# Altium schematic sheet GENERAL-IO.SchDoc
size A3
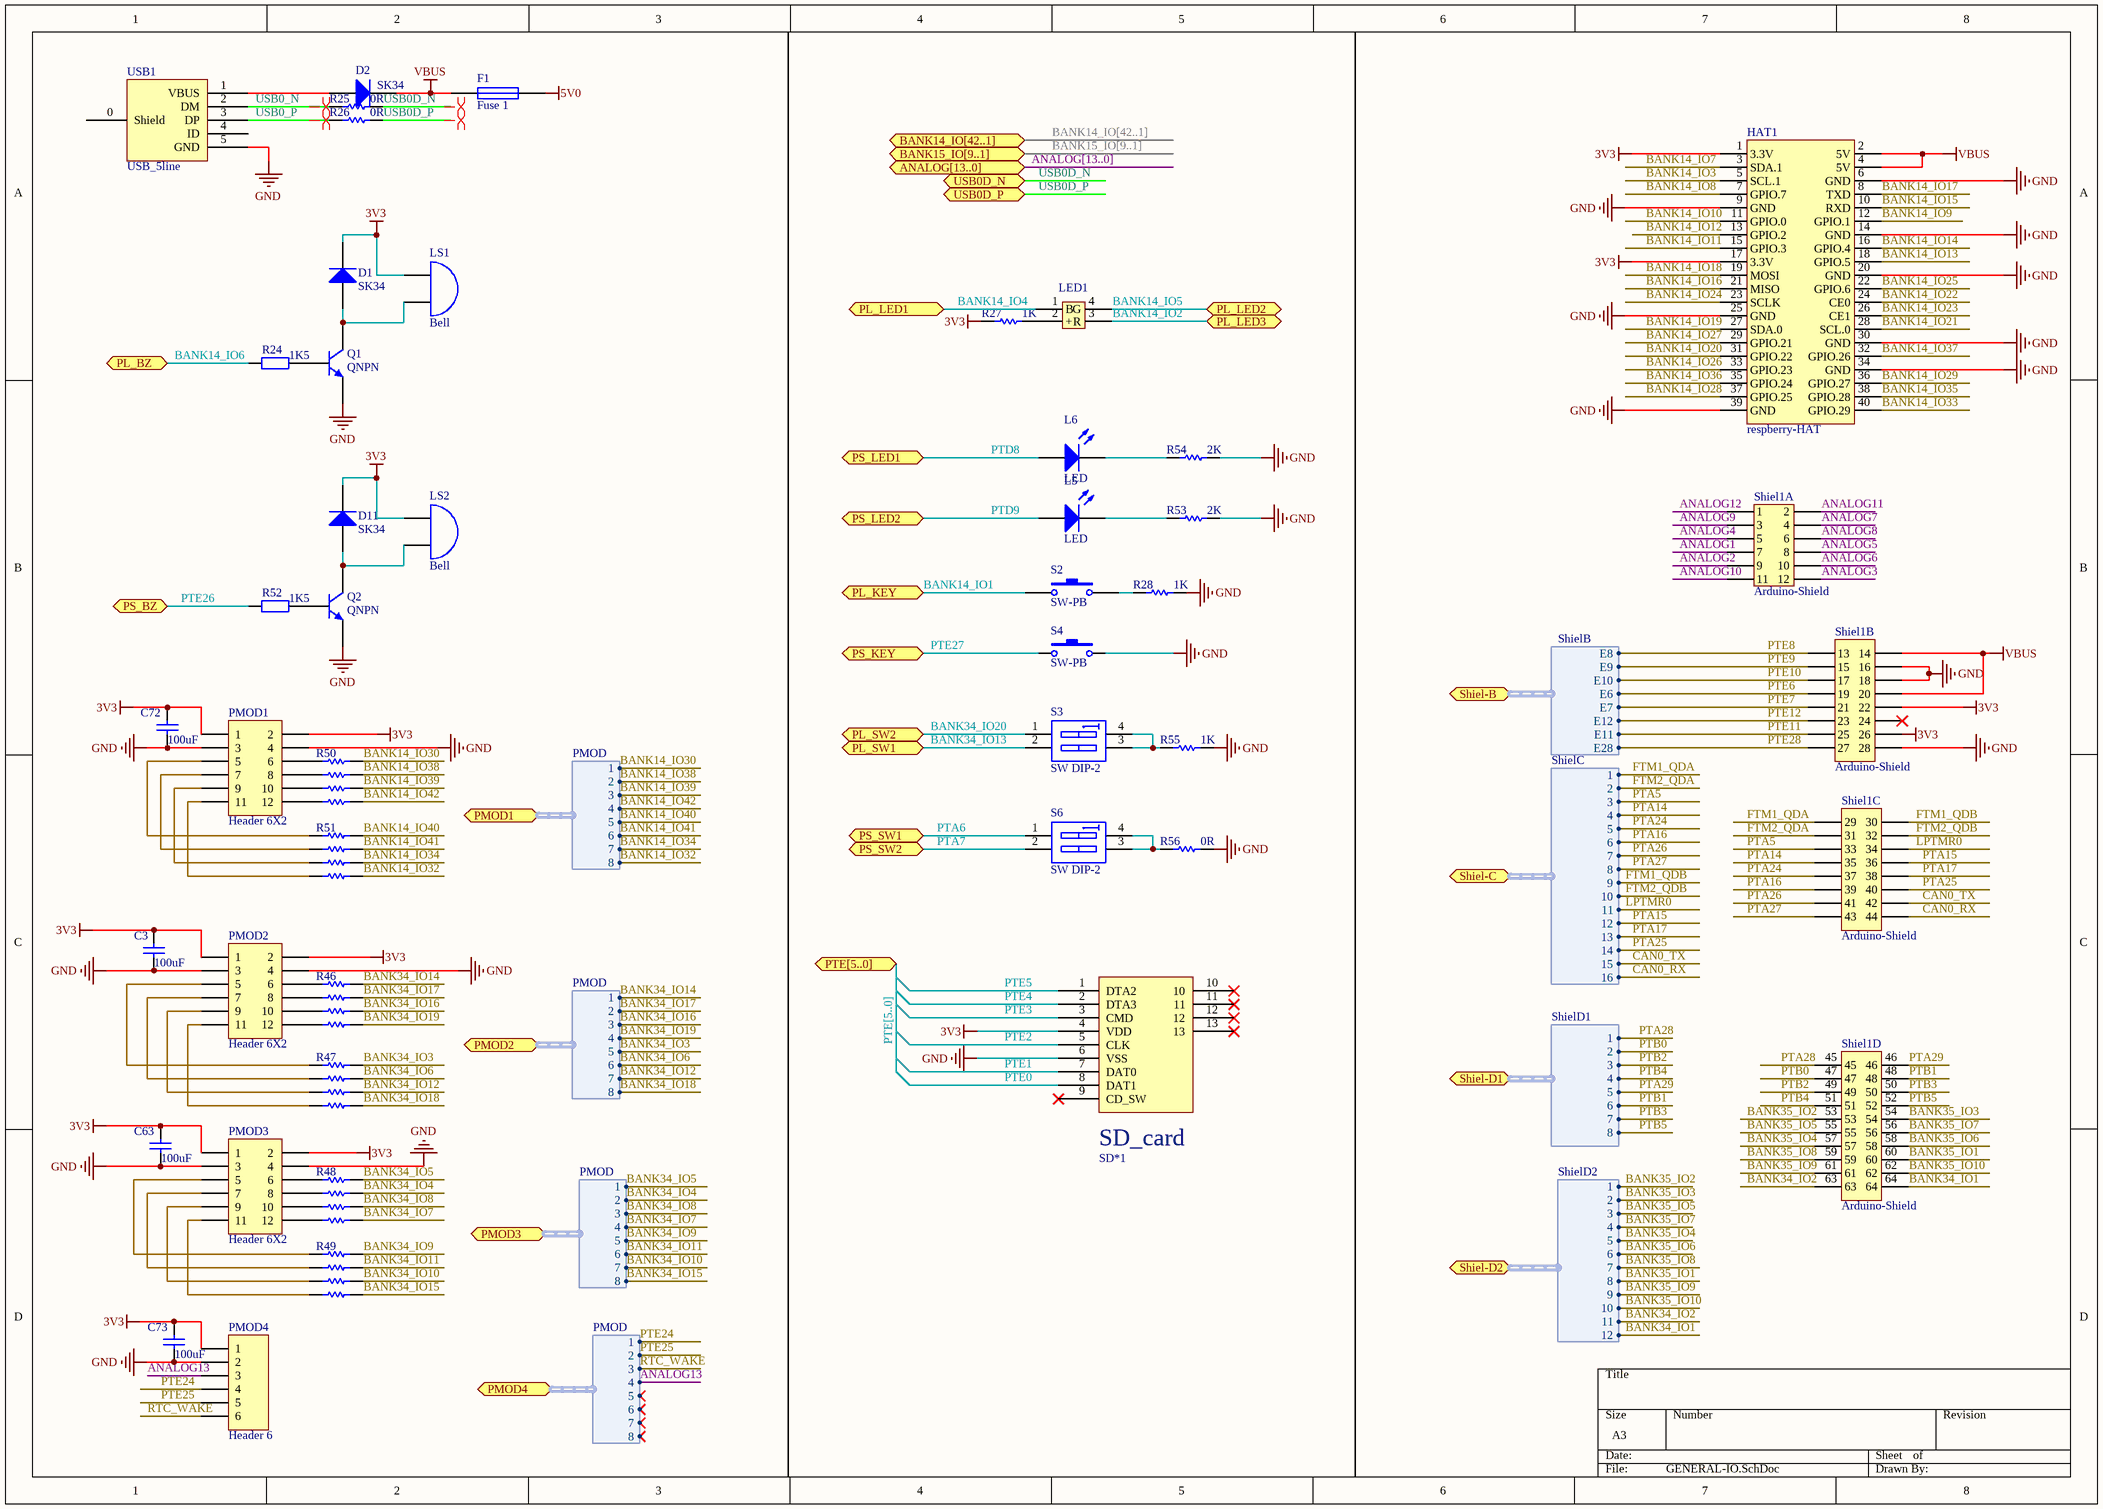
[diagram p0: GENERAL-IO.SchDoc]

## Parts
C3  value 100uF  [1206]  (hidden comment: Cap)
C63  value 100uF  [1206]  (hidden comment: Cap)
C72  value 100uF  [1206]  (hidden comment: Cap)
C73  value 100uF  [1206]  (hidden comment: Cap)
D1  SK34  [1206]
D2  SK34  [1206]
D11  SK34  [1206]
F1  Fuse 1  [1206]
HAT1  respberry-HAT  [SMT-HAT]
L5  LED  [1608[0603]]
L6  LED  [1608[0603]]
LED1  RGB_LED1206  [RGB]  (value not drawn)
LS1  Bell  [MLT-5020 BZ]
LS2  Bell  [BZ]
PMOD1  Header 6X2  [HDR2X6]
PMOD2  Header 6X2  [HDR2X6]
PMOD3  Header 6X2  [HDR2X6]
PMOD4  Header 6  [HDR1X6]
Q1  QNPN  [SOT23_N]
Q2  QNPN  [SOT23_N]
R24  value 1K5  [1608[0603]]  (hidden comment: Res2)
R25  value 0R  [1608[0603]]  (hidden comment: Res)
R26  value 0R  [1608[0603]]  (hidden comment: Res)
R27  value 1K  [1608[0603]]  (hidden comment: Res)
R28  value 1K  [1608[0603]]  (hidden comment: Res)
R46  res*4  [0603*4]  (value not drawn)
R47  res*4  [0603*4]  (value not drawn)
R48  res*4  [0603*4]  (value not drawn)
R49  res*4  [0603*4]  (value not drawn)
R50  res*4  [0603*4]  (value not drawn)
R51  res*4  [0603*4]  (value not drawn)
R52  value 1K5  [1608[0603]]  (hidden comment: Res2)
R53  value 2K  [1608[0603]]  (hidden comment: Res)
R54  value 2K  [1608[0603]]  (hidden comment: Res)
R55  value 1K  [1608[0603]]  (hidden comment: Res)
R56  value 0R  [1608[0603]]  (hidden comment: Res)
S2  SW-PB  [key 3*4*2]
S3  SW DIP-2  [sw*2]
S4  SW-PB  [key 3*4*2]
S6  SW DIP-2  [sw*2]
SD*1  TF_card  [TF卡座(短体)]  (value not drawn)
Shiel1  Arduino-Shield  [SMT-B-Shield]  (parts A,B,C,D of 4)
USB1  USB_5line  [USB-MICRO-5P-2F]

## Ports
ANALOG[13..0] (harness Flexbus), BANK14_IO[42..1], BANK15_IO[9..1], PL_BZ, PL_KEY, PL_LED1, PL_LED2, PL_LED3, PL_SW1, PL_SW2, PMOD1 (harness PMOD), PMOD2 (harness PMOD), PMOD3 (harness PMOD), PMOD4 (harness PMOD), PS_BZ, PS_KEY, PS_LED1, PS_LED2, PS_SW1, PS_SW2, PTE[5..0], Shiel-B (harness ShielB), Shiel-C (harness ShielC), Shiel-D1 (harness ShielD1), Shiel-D2 (harness ShielD2), USB0D_N, USB0D_P

## Harnesses
ShielB: E8, E9, E10, E6, E7, E12, E11, E28
PMOD: 1, 2, 3, 4, 5, 6, 7, 8
ShielC: 1, 2, 3, 4, 5, 6, 7, 8, 9, 10, 11, 12, 13, 14, 15, 16
ShielD1: 1, 2, 3, 4, 5, 6, 7, 8
ShielD2: 1, 2, 3, 4, 5, 6, 7, 8, 9, 10, 11, 12

## Nets
3V3: C3.1 C63.1 C72.1 C73.1 D1.2(K) D11.2(K) HAT1.1(3.3V) HAT1.17(3.3V) LS1.1(A) LS2.1(A) PMOD1.1 PMOD1.2 PMOD2.1 PMOD2.2 PMOD3.1 PMOD3.2 PMOD4.1 R27.2 SD*1.4(VDD) Shiel1.22 Shiel1.26
5V0: F1.1
GND: C3.2 C63.2 C72.2 C73.2 HAT1.6(GND) HAT1.9(GND) HAT1.14(GND) HAT1.20(GND) HAT1.25(GND) HAT1.30(GND) HAT1.34(GND) HAT1.39(GND) PMOD1.3 PMOD1.4 PMOD2.3 PMOD2.4 PMOD3.3 PMOD3.4 PMOD4.2 Q1.3(E) Q2.3(E) R28.1 R53.1 R54.1 R55.1 R56.1 S4.2 SD*1.6(VSS) Shiel1.16 Shiel1.18 Shiel1.28 USB1.5(GND)
VBUS: D2.2(K) F1.2 HAT1.2(5V) HAT1.4(5V) Shiel1.14 Shiel1.20
ANALOG1: Shiel1.7
ANALOG2: Shiel1.9
ANALOG3: Shiel1.12
ANALOG4: Shiel1.5
ANALOG5: Shiel1.8
ANALOG6: Shiel1.10
ANALOG7: Shiel1.4
ANALOG8: Shiel1.6
ANALOG9: Shiel1.3
ANALOG10: Shiel1.11
ANALOG11: Shiel1.2
ANALOG12: Shiel1.1
ANALOG13: PMOD4.3 ; port PMOD4.4
BANK14_IO1: S2.1 ; port PL_KEY
BANK14_IO2: LED1.3(R) ; port PL_LED3
BANK14_IO3: HAT1.5(SCL.1)
BANK14_IO4: LED1.1(B) ; port PL_LED1
BANK14_IO5: LED1.4(G) ; port PL_LED2
BANK14_IO6: R24.2 ; port PL_BZ
BANK14_IO7: HAT1.3(SDA.1)
BANK14_IO8: HAT1.7(GPIO.7)
BANK14_IO9: HAT1.12(GPIO.1)
BANK14_IO10: HAT1.11(GPIO.0)
BANK14_IO11: HAT1.15(GPIO.3)
BANK14_IO12: HAT1.13(GPIO.2)
BANK14_IO13: HAT1.18(GPIO.5)
BANK14_IO14: HAT1.16(GPIO.4)
BANK14_IO15: HAT1.10(RXD)
BANK14_IO16: HAT1.21(MISO)
BANK14_IO17: HAT1.8(TXD)
BANK14_IO18: HAT1.19(MOSI)
BANK14_IO19: HAT1.27(SDA.0)
BANK14_IO20: HAT1.31(GPIO.22)
BANK14_IO21: HAT1.28(SCL.0)
BANK14_IO22: HAT1.24(CE0)
BANK14_IO23: HAT1.26(CE1)
BANK14_IO24: HAT1.23(SCLK)
BANK14_IO25: HAT1.22(GPIO.6)
BANK14_IO26: HAT1.33(GPIO.23)
BANK14_IO27: HAT1.29(GPIO.21)
BANK14_IO28: HAT1.37(GPIO.25)
BANK14_IO29: HAT1.36(GPIO.27)
BANK14_IO30: R50.2 ; port PMOD1.1
BANK14_IO32: R51.8 ; port PMOD1.8
BANK14_IO33: HAT1.40(GPIO.29)
BANK14_IO34: R51.6 ; port PMOD1.7
BANK14_IO35: HAT1.38(GPIO.28)
BANK14_IO36: HAT1.35(GPIO.24)
BANK14_IO37: HAT1.32(GPIO.26)
BANK14_IO38: R50.4 ; port PMOD1.2
BANK14_IO39: R50.6 ; port PMOD1.3
BANK14_IO40: R51.2 ; port PMOD1.5
BANK14_IO41: R51.4 ; port PMOD1.6
BANK14_IO42: R50.8 ; port PMOD1.4
BANK34_IO1: Shiel1.64 ; port Shiel-D2.12
BANK34_IO2: Shiel1.63 ; port Shiel-D2.11
BANK34_IO3: R47.2 ; port PMOD2.5
BANK34_IO4: R48.4 ; port PMOD3.2
BANK34_IO5: R48.2 ; port PMOD3.1
BANK34_IO6: R47.4 ; port PMOD2.6
BANK34_IO7: R48.8 ; port PMOD3.4
BANK34_IO8: R48.6 ; port PMOD3.3
BANK34_IO9: R49.2 ; port PMOD3.5
BANK34_IO10: R49.6 ; port PMOD3.7
BANK34_IO11: R49.4 ; port PMOD3.6
BANK34_IO12: R47.6 ; port PMOD2.7
BANK34_IO13: S3.2(A2) ; port PL_SW1
BANK34_IO14: R46.2 ; port PMOD2.1
BANK34_IO15: R49.8 ; port PMOD3.8
BANK34_IO16: R46.6 ; port PMOD2.3
BANK34_IO17: R46.4 ; port PMOD2.2
BANK34_IO18: R47.8 ; port PMOD2.8
BANK34_IO19: R46.8 ; port PMOD2.4
BANK34_IO20: S3.1(A1) ; port PL_SW2
BANK35_IO1: Shiel1.60 ; port Shiel-D2.8
BANK35_IO2: Shiel1.53 ; port Shiel-D2.1
BANK35_IO3: Shiel1.54 ; port Shiel-D2.2
BANK35_IO4: Shiel1.57 ; port Shiel-D2.5
BANK35_IO5: Shiel1.55 ; port Shiel-D2.3
BANK35_IO6: Shiel1.58 ; port Shiel-D2.6
BANK35_IO7: Shiel1.56 ; port Shiel-D2.4
BANK35_IO8: Shiel1.59 ; port Shiel-D2.7
BANK35_IO9: Shiel1.61 ; port Shiel-D2.9
BANK35_IO10: Shiel1.62 ; port Shiel-D2.10
CAN0_RX: Shiel1.44 ; port Shiel-C.16
CAN0_TX: Shiel1.42 ; port Shiel-C.15
FTM1_QDA: Shiel1.29 ; port Shiel-C.1
FTM1_QDB: Shiel1.30 ; port Shiel-C.9
FTM2_QDA: Shiel1.31 ; port Shiel-C.2
FTM2_QDB: Shiel1.32 ; port Shiel-C.10
LPTMR0: Shiel1.34 ; port Shiel-C.11
PTA5: Shiel1.33 ; port Shiel-C.3
PTA6: S6.1(A1) ; port PS_SW1
PTA7: S6.2(A2) ; port PS_SW2
PTA14: Shiel1.35 ; port Shiel-C.4
PTA15: Shiel1.36 ; port Shiel-C.12
PTA16: Shiel1.39 ; port Shiel-C.6
PTA17: Shiel1.38 ; port Shiel-C.13
PTA24: Shiel1.37 ; port Shiel-C.5
PTA25: Shiel1.40 ; port Shiel-C.14
PTA26: Shiel1.41 ; port Shiel-C.7
PTA27: Shiel1.43 ; port Shiel-C.8
PTA28: Shiel1.45 ; port Shiel-D1.1
PTA29: Shiel1.46 ; port Shiel-D1.5
PTB0: Shiel1.47 ; port Shiel-D1.2
PTB1: Shiel1.48 ; port Shiel-D1.6
PTB2: Shiel1.49 ; port Shiel-D1.3
PTB3: Shiel1.50 ; port Shiel-D1.7
PTB4: Shiel1.51 ; port Shiel-D1.4
PTB5: Shiel1.52 ; port Shiel-D1.8
PTD8: L6.1(A) ; port PS_LED1
PTD9: L5.1(A) ; port PS_LED2
PTE0: SD*1.8(DAT1)
PTE1: SD*1.7(DAT0)
PTE2: SD*1.5(CLK)
PTE3: SD*1.3(CMD)
PTE4: SD*1.2(DTA3)
PTE5: SD*1.1(DTA2)
PTE6: Shiel1.19 ; port Shiel-B.E6
PTE7: Shiel1.21 ; port Shiel-B.E7
PTE8: Shiel1.13 ; port Shiel-B.E8
PTE9: Shiel1.15 ; port Shiel-B.E9
PTE10: Shiel1.17 ; port Shiel-B.E10
PTE11: Shiel1.25 ; port Shiel-B.E11
PTE12: Shiel1.23 ; port Shiel-B.E12
PTE24: PMOD4.4 ; port PMOD4.1
PTE25: PMOD4.5 ; port PMOD4.2
PTE26: R52.2 ; port PS_BZ
PTE27: S4.1 ; port PS_KEY
PTE28: Shiel1.27 ; port Shiel-B.E28
RTC_WAKE: PMOD4.6 ; port PMOD4.3
USB0_N: R25.1 USB1.2(DM)
USB0_P: R26.1 USB1.3(DP)
USB0D_N: R25.2 ; port USB0D_N
USB0D_P: R26.2 ; port USB0D_P
NetD1_1: D1.1(A) LS1.2(B) Q1.1(C)
NetD2_1: D2.1(A) USB1.1(VBUS)
NetD11_1: D11.1(A) LS2.2(B) Q2.1(C)
NetL5_2: L5.2(K) R53.2
NetL6_2: L6.2(K) R54.2
NetLED1_2: LED1.2(+) R27.1
NetPMOD1_5: PMOD1.5 R51.1
NetPMOD1_6: PMOD1.6 R50.1
NetPMOD1_7: PMOD1.7 R51.3
NetPMOD1_8: PMOD1.8 R50.3
NetPMOD1_9: PMOD1.9 R51.5
NetPMOD1_10: PMOD1.10 R50.5
NetPMOD1_11: PMOD1.11 R51.7
NetPMOD1_12: PMOD1.12 R50.7
NetPMOD2_5: PMOD2.5 R47.1
NetPMOD2_6: PMOD2.6 R46.1
NetPMOD2_7: PMOD2.7 R47.3
NetPMOD2_8: PMOD2.8 R46.3
NetPMOD2_9: PMOD2.9 R47.5
NetPMOD2_10: PMOD2.10 R46.5
NetPMOD2_11: PMOD2.11 R47.7
NetPMOD2_12: PMOD2.12 R46.7
NetPMOD3_5: PMOD3.5 R49.1
NetPMOD3_6: PMOD3.6 R48.1
NetPMOD3_7: PMOD3.7 R49.3
NetPMOD3_8: PMOD3.8 R48.3
NetPMOD3_9: PMOD3.9 R49.5
NetPMOD3_10: PMOD3.10 R48.5
NetPMOD3_11: PMOD3.11 R49.7
NetPMOD3_12: PMOD3.12 R48.7
NetQ1_2: Q1.2(B) R24.1
NetQ2_2: Q2.2(B) R52.1
NetR28_2: R28.2 S2.2
NetR55_2: R55.2 S3.3(B2) S3.4(B1)
NetR56_2: R56.2 S6.3(B2) S6.4(B1)

Not connected (* = marked no-connect by the designer): SD*1 9(CD_SW)* 10* 11* 12* 13*; Shiel1 24*; USB1 0(Shield) 4(ID)

## Buses and harness runs
bus ANALOG[13..0]
bus BANK14_IO[42..1] = port BANK14_IO[42..1]
bus BANK15_IO[9..1] = port BANK15_IO[9..1]
bus PTE[5..0] = port PTE[5..0]

## Layout directives
differential pair: USB0_N, USB0_P, USB0D_N, USB0D_P

## Notes on the sheet
- (in symbol TF_card) SD_card

## Library data of the parts
C3 C63 C72 C73 = Cap: 贴片电容; Published: 8-Jun-2000; LatestRevisionDate: 17-Jul-2002; LatestRevisionNote: Re-released for DXP Platform.; PackageReference: RAD-0.3; Publisher: Altium Limited
D1 D2 D11 = Diode 1N4148: High Conductance Fast Diode; LatestRevisionDate: 17-Jul-2002; LatestRevisionNote: Re-released for DXP Platform.; DatasheetDocument: 1997; PackageReference: DO-35; Publisher: Altium Limited; Code_JEDEC: DO-204-AH; ComponentLink1Description: Manufacturer Link; ComponentLink2Description: Datasheet; ComponentLink2URL: http://www.fairchildsemi.com/ds/1N%2F1N4148.pdf
F1 = Fuse 1: Fuse; Published: 8-Jun-2000; LatestRevisionDate: 17-Jul-2002; LatestRevisionNote: Re-released for DXP Platform.; PackageReference: PIN-W2/E2.8; Publisher: Altium Limited; PackageDescription: Thru-Hole; 2 Leads
LS1 LS2 = Bell: Electrical Bell; Published: 24-Mar-1999; LatestRevisionDate: 17-Jul-2002; LatestRevisionNote: Re-released for DXP Platform.; PackageReference: PIN2; Publisher: Altium Limited
PMOD1-PMOD3 = Header 6X2: Header, 6-Pin, Dual row; LatestRevisionDate: 17-Jul-2002; LatestRevisionNote: Re-released for DXP Platform.; Publisher: Altium Limited
PMOD4 = Header 6: Header, 6-Pin; LatestRevisionDate: 17-Jul-2002; LatestRevisionNote: Re-released for DXP Platform.; Publisher: Altium Limited
Q1 Q2 = QNPN: NPN Bipolar Transistor; pin to pad: 2>3 3>2; Published: 8-Jun-2000; LatestRevisionDate: 29-May-2009; LatestRevisionNote: IPC-7351 Footprint Added.; PackageVersion: Aug-1999; PackageReference: SOT-23B; Publisher: Altium Limited; PackageDescription: 3-Pin SOT-23 Package 0.95 mm Pitch, 2.4 mm Lead Span
R24 R52 = Res2: Resistor; Published: 8-Jun-2000; LatestRevisionDate: 17-Jul-2002; LatestRevisionNote: Re-released for DXP Platform.; PackageReference: AXIAL-0.4; Publisher: Altium Limited; PackageDescription: Axial Device, Thru-Hole; 2 Leads; 0.4 in Pin Spacing
R25-R28 R53-R56 = Res: 贴片电阻; Published: 8-Jun-2000; LatestRevisionDate: 17-Jul-2002; LatestRevisionNote: Re-released for DXP Platform.; PackageReference: AXIAL-0.3; Publisher: Altium Limited
S2 S4 = SW-PB: Switch
  S2: Published: 24-Mar-1999; LatestRevisionDate: 17-Jul-2002; LatestRevisionNote: Re-released for DXP Platform.; PackageReference: SPST-2; Publisher: Altium Limited; PackageDescription: Switch; 2 Leads
S3 S6 = SW DIP-2: DIP Switch, 2 Position, SPST; Published: 24-Mar-1999; LatestRevisionDate: 17-Jul-2002; LatestRevisionNote: Re-released for DXP Platform.; PackageReference: DIP-4; Publisher: Altium Limited